# EAGLE design MB-7SEGMENT-74HC595 (EAGLE 9.5.0)
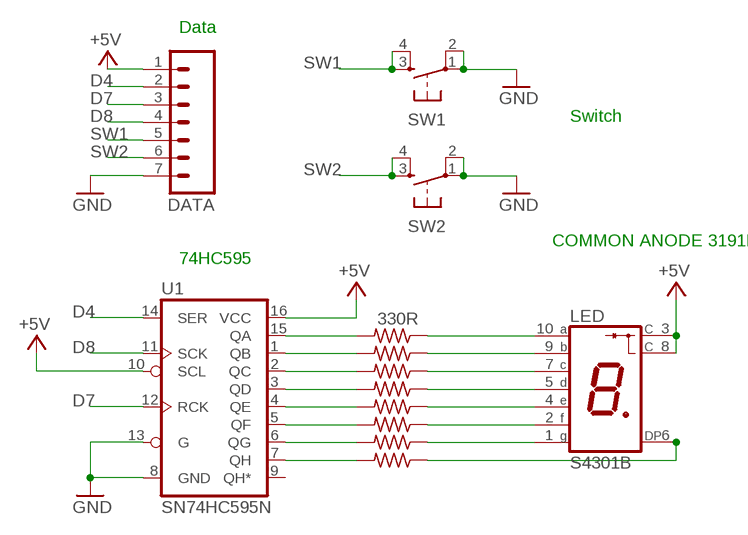
[diagram p0: schematic, sheet 1]

## Parts
DATA  M07  [1X07]
LED  S4301B  [S4301B]
R1  330R  R-US_0204/5  [0204/5]
R3  330R  R-US_0204/5  [0204/5]
R4  330R  R-US_0204/5  [0204/5]
R5  330R  R-US_0204/5  [0204/5]
R6  330R  R-US_0204/5  [0204/5]
R7  330R  R-US_0204/5  [0204/5]
R8  330R  R-US_0204/5  [0204/5]
R9  330R  R-US_0204/5  [0204/5]
SW1  DTS-6  [DTS-6]
SW2  DTS-6  [DTS-6]
U1  SN74HC595N  74HC595N  [DIP16]

## Nets
+5V [usbvcc]: DATA.1 LED.3(C) LED.8(C) U1.10(SCL) U1.16(VCC)
D4: DATA.2 U1.14(SER)
D7: DATA.3 U1.12(RCK)
D8: DATA.4 U1.11(SCK)
GND: DATA.7 SW1.1 SW1.2 SW2.1 SW2.2 U1.8(GND) U1.13(G)
N$1: LED.10(A) R1.1
N$2: LED.9(B) R3.1
N$4: R1.2 U1.15(QA)
N$5: R3.2 U1.1(QB)
N$6: R4.2 U1.2(QC)
N$7: R5.2 U1.3(QD)
N$8: R6.2 U1.4(QE)
N$10: R7.2 U1.5(QF)
N$11: R8.2 U1.6(QG)
N$12: R9.2 U1.7(QH)
N$14: LED.7(C) R4.1
N$15: LED.5(D) R5.1
N$16: LED.4(E) R6.1
N$17: LED.2(F) R7.1
N$18: LED.1(G) R8.1
N$19: LED.6(DP) R9.1
SW1: DATA.5 SW1.3 SW1.4
SW2: DATA.6 SW2.3 SW2.4
Unconnected: U1.9(QH*)

## Notes on the sheet
- Data
- Switch
- COMMON ANODE 3191B
- 74HC595

## Library data of the parts
DATA = SparkFun:M07: Header 7 Standard 7-pin 0.1" header. Use with straight break away headers (SKU : PRT-00116), right angle break away headers (PRT-00553), swiss pins (PRT-00743), machine pins (PRT-00117), and female headers (PRT-00115). NOTES ON THE VARIANTS LOCK and LOCK_LONGPADS... This footprint was designed to help hold the alignment of a through-hole component (i.e. 7-pin header) while soldering it into place. You may notice that each hole has been shifted either up or down by 0.005 of an inch from it's more standard position (which is usually a perfectly straight line). This slight alteration caused the pins (the squares in the middle) to touch the edges of the holes. Because they are alternating, it causes a "brace" to hold the header in place. 0.005 has proven to be the perfect amount of "off-center" position when using our standard breakaway headers. Although looks a little odd when you look at the bare footprint, once you have a header in there, the alteration is very hard to notice. Also, if you push a header all the way into place, it is covered up entirely on the bottom side. This idea of altering the position of holes to aid alignment will be further integrated into the Sparkfun Library for other footprints. It can help hold any component with 3 or more connection pins.
LED = led-7-segment:S4301B: Single Digit Seven-Segment Display (cathode common) Source: LITEON .. S4301B.pdf; OC_FARNELL: unknown; OC_NEWARK: unknown
R1 R3-R9 = adafruit:R-US_: RESISTOR, American symbol
SW1 SW2 = switch-tact:DTS-6
U1 = SparkFun-IC-Logic:74*595: 8-Bit Shift Register (Serial to Parallel) Datasheet <http://cdn.sparkfun.com/datasheets/BreakoutBoards/MM74HC595.pdf> SparkFun Products SparkFun Shift Register Breakout - 74HC595 <https://www.sparkfun.com/products/10680> (BOB-10680); PROD_ID: IC-13123

## Net classes
3 usbvcc: width 0.508 mm, drill 0.61 mm, clearance 0.254 mm

## Board
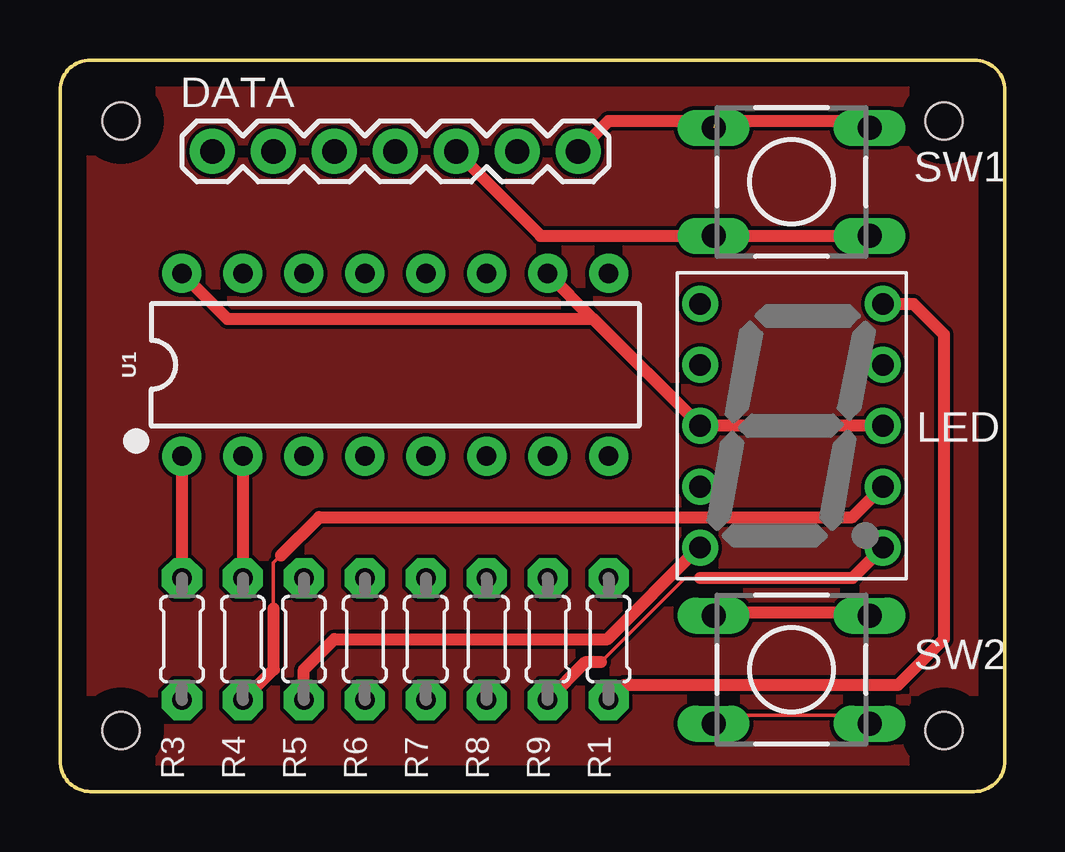
[diagram p1: board, top side]
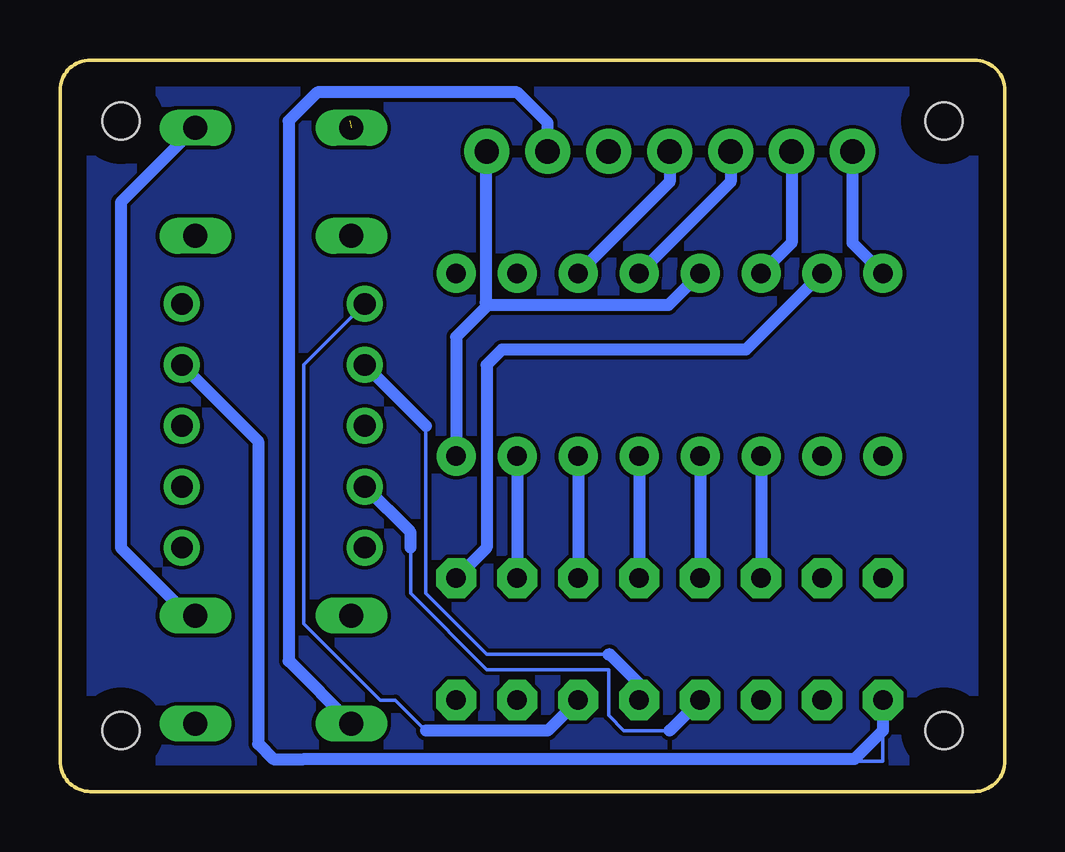
[diagram p2: board, bottom side, seen from below]

Size 39.37 x 30.48 mm. Coordinates in mm from the lower left corner, seen from the top.
Outline: 1.27,0 arc-90 0,1.27 0,29.21 arc-90 1.27,30.48 38.1,30.48 arc-90 39.37,29.21 39.37,1.27 arc-90 38.1,0 1.27,0
Copper layers (1*16): Top 0.035mm / dielectric 1.5mm / Bottom 0.035mm
Design rules "default": minimum track width 6mil, minimum drill 0.35mm, track to track 6mil, track to pad 6mil, pad to pad 6mil, via to via 6mil, smd to smd 6mil, copper to edge 40mil, drill to drill 6mil, minimum pad ring 10mil, minimum via ring 8mil, stop-mask expansion 4mil, vias tented up to drill 0mil, thermal gap 10mil
Holes 1.53 mm at 2.54,27.94 2.54,2.54 36.83,27.94 36.83,2.54

### Footprints (pad centres in the part's own frame; a part is rotated, then mirrored left to right if it is on the bottom)
1X07 = drill 1.016 pad 1.88: 1 0,0; 2 2.54,0; 3 5.08,0; 4 7.62,0; 5 10.16,0; 6 12.7,0; 7 15.24,0
S4301B = drill 0.9 pad 1.5: 1 -3.81,5.08; 2 -3.81,2.54; 3 -3.81,0; 4 -3.81,-2.54; 5 -3.81,-5.08; 6 3.81,-5.08; 7 3.81,-2.54; 8 3.81,0; 9 3.81,2.54; 10 3.81,5.08
0204/5 = drill 0.813 pad 1.676 octagon: 1 -2.54,0; 2 2.54,0
DTS-6 = drill 1 long: 1 -3.25,2.25; 2 3.25,2.25; 3 -3.25,-2.25; 4 3.25,-2.25
DIP16 = drill 0.813 pad 1.626: 1 -8.89,-3.81; 2 -6.35,-3.81; 3 -3.81,-3.81; 4 -1.27,-3.81; 5 1.27,-3.81; 6 3.81,-3.81; 7 6.35,-3.81; 8 8.89,-3.81; 9 8.89,3.81; 10 6.35,3.81; 11 3.81,3.81; 12 1.27,3.81; 13 -1.27,3.81; 14 -3.81,3.81; 15 -6.35,3.81; 16 -8.89,3.81

### Placement (x,y rotation side)
DATA  6.35,26.67 0 top
LED  30.48,15.24 0 top
R1  22.86,6.35 90 top
R3  5.08,6.35 90 top
R4  7.62,6.35 90 top
R5  10.16,6.35 90 top
R6  12.7,6.35 90 top
R7  15.24,6.35 90 top
R8  17.78,6.35 90 top
R9  20.32,6.35 90 top
SW1  30.48,25.4 0 top
SW2  30.48,5.08 0 top
U1  13.97,17.78 0 top

### Tracks (layer width: path | path; a pad name or v marks a point on that pad's centre or on a via)
+5V
  Top 0.508: LED.8 LED.3 22.23,19.68 | 22.23,19.68 U1.10 | U1.16 6.99,19.68 22.23,19.68
  Bottom 0.508: U1.16 6.35,22.86 DATA.1
B
  pour Bottom: 0,30.48 0,0 39.37,0 39.37,30.48
D4
  Bottom 0.508: DATA.2 8.89,22.86 U1.14
D7
  Bottom 0.508: DATA.3 11.43,25.4 U1.12
D8
  Bottom 0.508: DATA.4 13.97,25.4 U1.11
GND  (1 unrouted)
  Top 0.152: 33.7,7.47 SW2.2 | 27.3,27.94 33.66,27.94 33.7,27.79 SW1.2
  Top 0.508: DATA.7 22.86,27.94 33.54,27.94 33.7,27.79 | SW2.1 27.37,7.47 33.7,7.47
  Bottom 0.152: 34.29,7.62 SW2.2
  Bottom 0.508: U1.13 14.02,20.27 21.54,20.27 | 21.54,20.27 22.86,18.95 U1.8 | 21.54,20.27 21.64,20.37 21.64,26.62 DATA.7 | 34.29,7.62 36.83,10.16 36.83,24.55 SW1.2
N$1
  Top 0.508: LED.10 35.56,20.32 36.83,19.05 36.83,6.35 34.92,4.45 23.5,4.45 R1.1
N$2
  Bottom 0.152: 27.94,1.27 5.08,1.27 5.08,2.54
  Bottom 0.508: R3.1 5.08,2.54 6.27,1.35 27.94,1.35 29.21,1.35 30.48,1.35 31.11,1.98 31.11,14.61 LED.9
N$4
  Bottom 0.508: U1.15 10.79,18.41 20.95,18.41 21.59,17.78 21.59,10.16 R1.2
N$5
  Top 0.508: U1.1 R3.2
N$6
  Top 0.508: U1.2 R4.2
N$7
  Bottom 0.508: U1.3 R5.2
N$8
  Bottom 0.508: U1.4 R6.2
N$10
  Bottom 0.508: U1.5 R7.2
N$11
  Bottom 0.508: U1.6 R8.2
N$12
  Bottom 0.508: U1.7 R9.2
N$14
  Top 0.152: 9.21,9.84 8.89,9.53 8.89,7.62
  Top 0.508: LED.7 33.02,11.43 10.79,11.43 9.21,9.84 | R4.1 8.89,5.08 | 8.91,5.08 8.89,5.08 | 8.89,7.62 8.89,5.08
N$15
  Top 0.152: 22.86,6.35 LED.5
  Top 0.508: LED.5 26.62,10.16 22.81,6.35 11.43,6.35 10.16,5.08 R5.1
N$16
  Bottom 0.152: 24.77,10.16 24.77,8.26 21.59,5.08 16.51,5.08 16.51,3.17 15.88,2.54 13.97,2.54
  Bottom 0.508: 24.77,10.16 24.77,10.79 LED.4 | R6.1 13.97,2.54
N$17
  Bottom 0.152: 24.13,15.24 24.13,8.26 21.59,5.71 16.51,5.71
  Bottom 0.508: LED.2 24.13,15.24 | 16.51,5.71 16.46,5.71 15.24,4.49 R7.1
N$18
  Bottom 0.152: 24.13,2.54 25.4,3.81 26.04,3.81 29.21,6.99 29.21,17.78 LED.1
  Bottom 0.508: 24.13,2.54 19.05,2.54 R8.1
N$19
  Top 0.152: 26.67,8.89 26.04,8.89 22.54,5.4
  Top 0.508: 22.54,5.4 21.91,5.4 R9.1 | LED.6 33.02,8.89 26.67,8.89
SW1
  Top 0.508: DATA.5 20.03,23.15 SW1.3 SW1.4 | SW1.4 34,23.15 34.29,22.86 34.02,22.86 SW1.4
SW2
  Top 0.152: SW2.3 27.3,3.17 33.66,3.17 SW2.4
  Bottom 0.508: DATA.6 19.05,27.86 20.32,29.13 28.65,29.13 29.84,27.94 29.84,5.45 SW2.3
T
  pour Top: 0,30.48 0,0 39.37,0 39.37,30.48